# Altium schematic sheet USB.SchDoc
size A; SheetNumber: 2; SheetTotal: 3
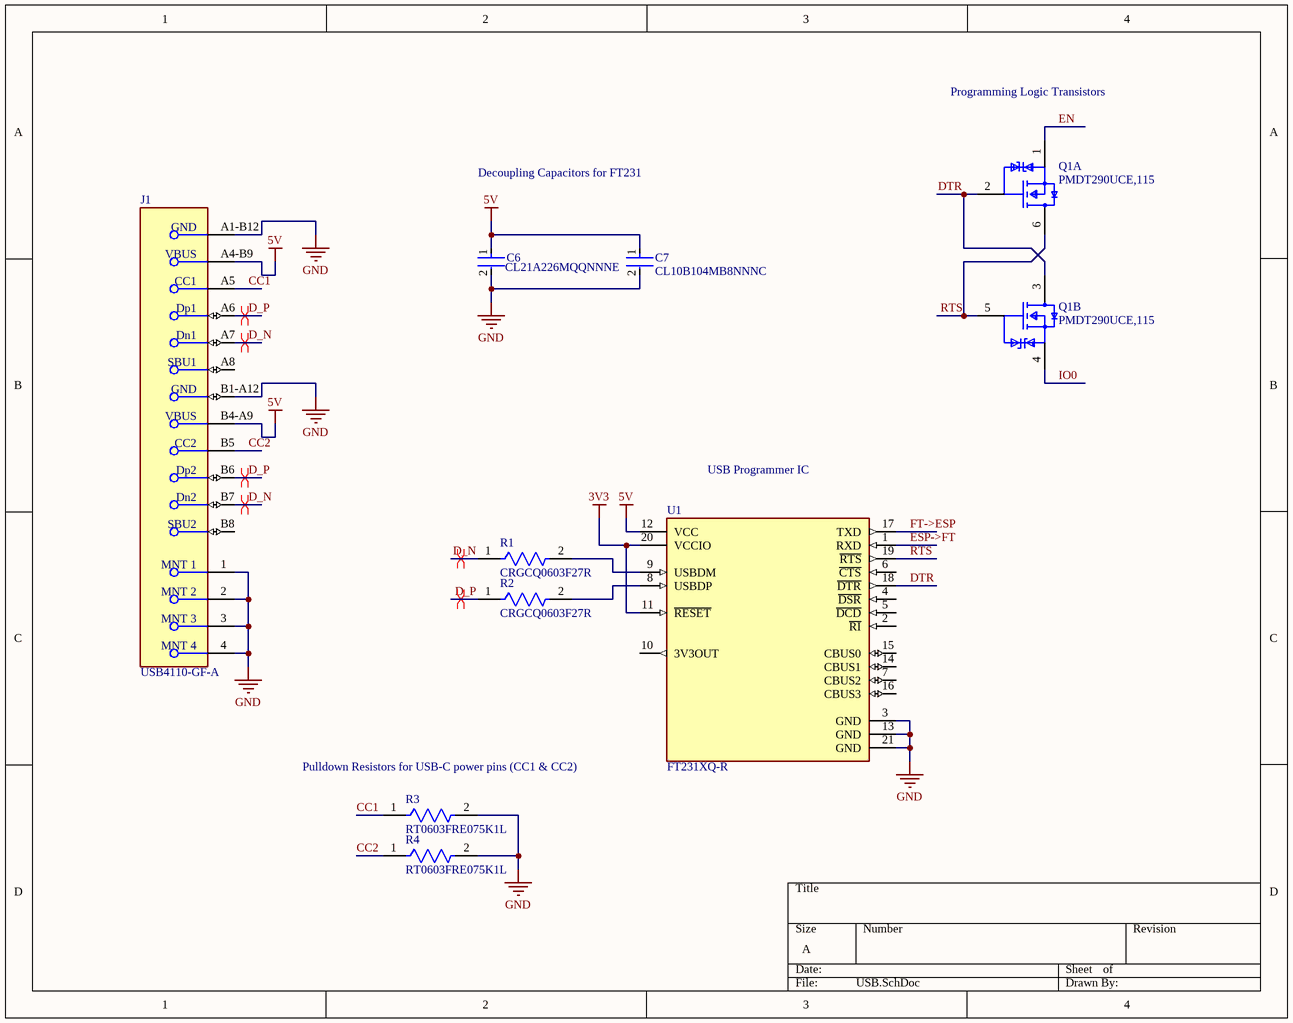
[diagram p0: USB.SchDoc]

## Parts
C6  CL21A226MQQNNNE  [FP-CL21-IPC_A]
C7  CL10B104MB8NNNC  [FP-CL10-IPC_C]
J1  USB4110-GF-A  [FP-USB4110-GF-A-MFG]
Q1  PMDT290UCE,115  [FP-SOT666-MFG]  (parts A,B of 2)
R1  CRGCQ0603F27R  [FP-CRGCQ0603-IPC_C]
R2  CRGCQ0603F27R  [FP-CRGCQ0603-IPC_C]
R3  RT0603FRE075K1L  [FP-RT0603-MFG]
R4  RT0603FRE075K1L  [FP-RT0603-MFG]
U1  FT231XQ-R  [FP-QFN-20-MFG]

## Nets
3V3: U1.11(~{RESET}) U1.20(VCCIO)
5V: C6.1 C7.1 J1.A4-B9(VBUS) J1.B4-A9(VBUS) U1.12(VCC)
GND: C6.2 C7.2 J1.1(MNT_1) J1.2(MNT_2) J1.3(MNT_3) J1.4(MNT_4) J1.A1-B12(GND) J1.B1-A12(GND) R3.2 R4.2 U1.3(GND) U1.13(GND) U1.21(GND)
CC1: J1.A5(CC1) R3.1
CC2: J1.B5(CC2) R4.1
D_N: J1.A7(Dn1) J1.B7(Dn2) R1.1
D_P: J1.A6(Dp1) J1.B6(Dp2) R2.1
DTR: Q1.2(G1) Q1.3(D2) U1.18(~{DTR})
EN: Q1.1(S1)
ESP->FT: U1.1(RXD)
FT->ESP: U1.17(TXD)
IO0: Q1.4(S2)
RTS: Q1.5(G2) Q1.6(D1) U1.19(~{RTS})
NetR1_2: R1.2 U1.9(USBDM)
NetR2_2: R2.2 U1.8(USBDP)

Not connected (* = marked no-connect by the designer): J1 A8(SBU1) B8(SBU2); U1 2(~{RI}) 4(~{DSR}) 5(~{DCD}) 6(~{CTS}) 7(CBUS2) 10(3V3OUT) 14(CBUS1) 15(CBUS0) 16(CBUS3)

## Layout directives
differential pair: D_N, D_P

## Notes on the sheet
- Programming Logic Transistors
- Decoupling Capacitors for FT231
- USB Programmer IC
- Pulldown Resistors for USB-C power pins (CC1 & CC2)

## Library data of the parts
C6 = CMP-13271-000185-1: CL21 Series 0805 22uF 6.3V ±20% Tolerance X5R Multilayer Ceramic Chip Capacitor; Height: 1.25mm; Length: 2mm; Capacitance: 22uF; Mount: Surface Mount; Dielectric: X5R; Voltage Rating (DC): 6.3V; Case Code (Metric): 2012; Depth: 1.25mm; Max Operating Temperature: 85°C; Voltage Rating: 6.3V; Width: 0.049inch; Case/Package: 0805; Radiation Hardening: No; Thickness: 0.055inch; Packaging: Tape and Reel; Package Quantity: 2000; Lead Free: Lead Free; Contact Plating: Tin; Min Operating Temperature: -55°C; Case Code (Imperial): 0805; Tolerance: 20%
C7 = CMP-13271-001724-1: Cap Ceramic 100nF 50V X7R ±20% Pad SMD 0603 +125°C T/R; Mount: Surface Mount; Lead Free: Lead Free; Max Operating Temperature: 125°C; Voltage Rating: 50V; Case Code (Imperial): 0603; Capacitance: 100nF; Height: 0.8mm; Length: 1.6mm; Tolerance: 20%; Case Code (Metric): 1608; Thickness: 0.035inch; Depth: 0.8mm; Width: 0.031inch; Package Quantity: 1; Min Operating Temperature: -55°C; Case/Package: 0603; Radiation Hardening: No; Voltage Rating (DC): 50V; Dielectric: X7R; Packaging: Tape and Reel
J1 = CMP-245163-000002-1: CONN USB 2.0 TYPE-C R/A SMT; Manufacturer: GCT; Conn Orientation: Right Angle; Usb Standard: USB 2.0; Voltage Rating: 20V; Current Rating: 3/4.25/1.25/0.25A; Number Of Contacts: 16; Is Female: yes; Shielding: true; Standoff Height: 0.1mm; Octopart: https://octopart.com/usb4110-gf-a-gct-103941985; Temperature: -40°C to +85°C; RoHS: TRUE; Automotive: No; Contact Material: Gold,Nickel; Device Class L1: Connectors; Device Class L2: USB Connectors; Package: 0; Lead Free: Yes; ComponentLink2URL: https://gct.co/files/drawings/usb4110.pdf; Temperature Range High: +85°C; Temperature Range Low: -40°C; Height: 3.46mm; Manufacturer Part Number: USB4110-GF-A; ComponentLink2Description: Datasheet; Device Class L3: unset; Digikey Description: CONN USB 2.0 TYPE-C R/A SMT; Category: Conn
Q1 = CMP-14409-000021-1: MOSFET N/P-CH 20V SOT666
R1 R2 = CMP-03211-005286-1: CRGCQ 0603 27R 1%; Manufacturer: TE Connectivity; Value: 27Ω; Power Rating: 0.1W; Voltage Rating: 75V; Tolerance: 0.01; Temperature Coefficient: ±200ppm/°C; ComponentLink2URL: https://www.te.com/commerce/DocumentDelivery/DDEController?Action=showdoc&DocId=Data+Sheet%7F1773204-3%7F1%7Fpdf%7FEnglish%7FENG_DS_1773204-3_1.pdf%7F4-2176339-332; ComponentLink2Description: Datasheet; Height: 0.55mm; Composition: Thick Film; Device Class L3: Chip SMD Resistors; Ambient Temperature Range High: +70°C; Device Class L2: Resistors; Package: CRGCQ0603; Digikey Description: CRGCQ 0603 27R 1%; Resistance: 27Ω; RoHS: TRUE; Temperature: -55°C to +155°C; Series: CRGCQ; Manufacturer Part Number: CRGCQ0603F27R; Category: Res; Device Class L1: Passive Components; Octopart: https://octopart.com/crgcq0603f27r-te+connectivity-91018062; Temperature Range High: +155°C; Lead Free: Yes; Ipc Land Pattern Name: RESC16080X45; Temperature Range Low: -55°C
R3 R4 = CMP-2000-04778-2: RES SMD 5.1K OHM 1% 1/10W 0603; Manufacturer: Yageo; Value: 5.1KΩ; Temperature Coefficient: 50 ppm/°C; Power Rating: 0.1W; Voltage Rating: 75V; Tolerance: 0.01; Lead Free: Yes; Temperature Range High: +155°C; Package: RT0603; Resistance: 5.1KΩ; Series: RT; Footprint Url: http://www.yageo.com/exep/pages/download/literatures/PYu-R_Mount_10.pdf; Ipc Land Pattern Name: RESC16080X45; Mouser Description: Res Thin Film 0603 5.1K Ohm 1% 0.1W(1/10W) ±50ppm/C Epoxy Pad SMD T/R; Octopart: https://octopart.com/rt0603fre075k1l-yageo-1421390; ComponentLink2URL: http://www.yageo.com/documents/recent/PYu-RT_1-to-0.01_RoHS_L_9.pdf; Manufacturer Part Number: RT0603FRE075K1L; RoHS: TRUE; Device Class L3: Chip SMD Resistors; Digikey Description: RES SMD 5.1K OHM 1% 1/10W 0603; Temperature: -55°C to +155°C; Height: 0.55mm; Automotive: No; Device Class L1: Passive Components; Temperature Range Low: -55°C; Category: Res; Composition: Thin Film; ComponentLink2Description: Datasheet; Device Class L2: Resistors
U1 = CMP-0248-00001-3: IC USB SERIAL FULL UART 20QFN; Data Rate: 12Mbps; Operating Supply Current: 8mA; Min Supply Voltage: 2.97V; Max Supply Voltage: 5.5V; Number of Channels: 1; Min Operating Temperature: -40°C; Case/Package: QFN; Mount: Surface Mount; Number of Pins: 20; Interface: UART; Lead Free: Lead Free; Package Quantity: 5000; Weight: 0.004339oz; Packaging: Tape and Reel; Max Operating Temperature: 85°C